# Altium project Nexie.PrjPcb
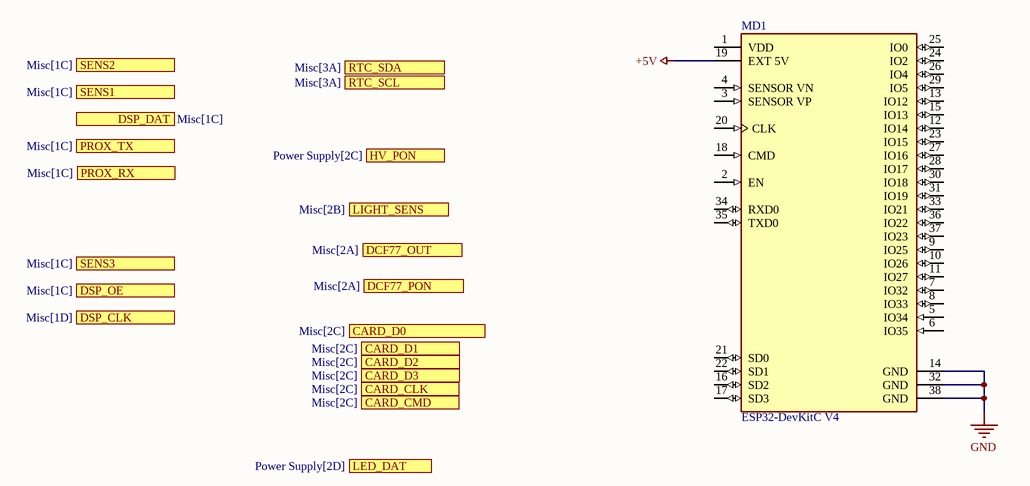
[diagram p0: MCU.SchDoc]
4 sheets, 70 parts. Net scope: flat (ports and power ports of the same name join across sheets).
Board files: PCB1.PcbDoc, PCB2.PcbDoc
Sheets:
  MCU.SchDoc
  Power Supply.SchDoc
  Misc.SchDoc
  Display.SchDoc

## Sheet MCU.SchDoc
size A; SheetNumber: 1; SheetTotal: 4

### Parts
MD1  ESP32-DevKitC V4  [FP-ESP32-DevKitC_V4-MFG]

### Ports
CARD_CLK (see Misc[2C]), CARD_CMD (see Misc[2C]), CARD_D0 (see Misc[2C]), CARD_D1 (see Misc[2C]), CARD_D2 (see Misc[2C]), CARD_D3 (see Misc[2C]), DCF77_OUT (see Misc[2A]), DCF77_PON (see Misc[2A]), DSP_CLK (see Misc[1D]), DSP_DAT (see Misc[1C]), DSP_OE (see Misc[1C]), HV_PON (see Power Supply[2C]), LED_DAT (see Power Supply[2D]), LIGHT_SENS (see Misc[2B]), PROX_RX (see Misc[1C]), PROX_TX (see Misc[1C]), RTC_SCL (see Misc[3A]), RTC_SDA (see Misc[3A]), SENS1 (see Misc[1C]), SENS2 (see Misc[1C]), SENS3 (see Misc[1C])

### Nets
+5V: MD1.19(EXT_5V)
GND: MD1.14(GND) MD1.32(GND) MD1.38(GND)

Not connected (* = marked no-connect by the designer): MD1 1(VDD) 2(EN) 3(SENSOR_VP) 4(SENSOR_VN) 5(IO34) 6(IO35) 7(IO32) 8(IO33) 9(IO25) 10(IO26) 11(IO27) 12(IO14) 13(IO12) 15(IO13) 16(SD2) 17(SD3) 18(CMD) 20(CLK) 21(SD0) 22(SD1) 23(IO15) 24(IO2) 25(IO0) 26(IO4) 27(IO16) 28(IO17) 29(IO5) 30(IO18) 31(IO19) 33(IO21) 34(RXD0) 35(TXD0) 36(IO22) 37(IO23)

### Library data of the parts
MD1 = CMP-194065-000004-1: WiFi Development Tools (802.11) ESP32 General Development Kit, ESP32-WROOM-32 on the board; Manufacturer: Espressif; Number Of Adc Channels: 16; Max Supply Voltage: 5V; Bandwidth: 2.4-2.5GHz; Interface: I2C,SPI,UART,I2S; Max Frequency: 2.5GHz; Min Supply Voltage: 2.7V; Number Of Gpio: 22; Package: ESP32-DevKitC V4; Device Class L2: RF Semiconductors and Devices; Device Class L3: Transceivers; ComponentLink2Description: Datasheet; Temperature Range Low: -40°C; ComponentLink2URL: https://docs.espressif.com/projects/esp-idf/en/latest/get-started/get-started-devkitc.html; RoHS: TRUE; Category: UNK; Automotive: No; Device Class L1: Integrated Circuits (ICs); Manufacturer Part Number: ESP32-DevKitC V4; Octopart: https://octopart.com/esp32-devkitc+v4-espressif+systems-107467262; Lead Free: Yes; Temperature: -40°C to

## Sheet Power Supply.SchDoc
size A; SheetNumber: 2; SheetTotal: 4
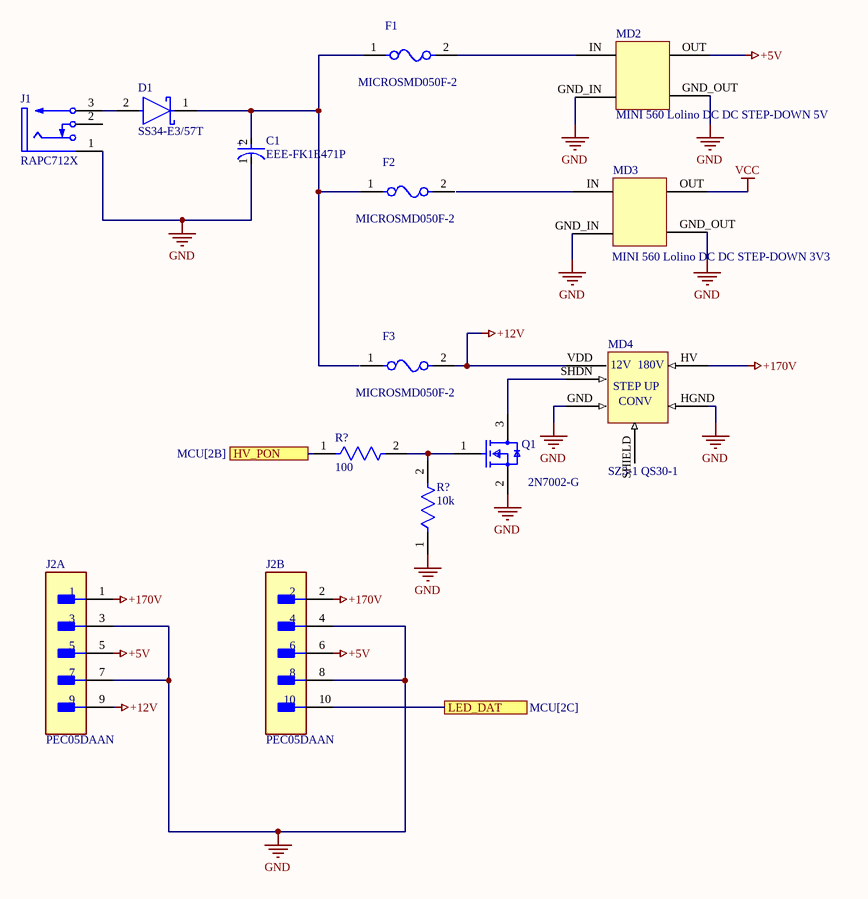
[diagram p1: Power Supply.SchDoc]

### Parts
(Parts that share a designator on the sheet are numbered #1, #2 ... from top to bottom, then left to right.)
C1  EEE-FK1E471P  [FP-FKG-MFG]
D1  SS34-E3/57T  [FP-95402-MFG]
F1  MICROSMD050F-2  [FP-microSMD-MFG]
F2  MICROSMD050F-2  [FP-microSMD-MFG]
F3  MICROSMD050F-2  [FP-microSMD-MFG]
J1  RAPC712X  [SWITCH-RAPC712X-3_V]
J2  PEC05DAAN  [FP-PEC05DAAN-MFG]  (parts A,B of 2)
MD2  MINI 560 Lolino DC DC STEP-DOWN 5V  [MINI 560 Lolino DC DC STEP-DOWN]
MD3  MINI 560 Lolino DC DC STEP-DOWN 3V3  [MINI 560 Lolino DC DC STEP-DOWN]
MD4  SZ3-1 QS30-1  [STEP_UP_180V]
Q1  2N7002-G  [FP-2N7002-G-IPC_C]
R?#1  100  [FP-RC0805-0_6-IPC_C]
R?#2  10k  [FP-RC0805-0_6-IPC_C]

### Ports
HV_PON (see MCU[2B]), LED_DAT (see MCU[2C])

### Nets
+5V: J2.5 J2.6 MD2.OUT
+12V: F3.2 J2.9 MD4.VDD
+170V: J2.1 J2.2 MD4.HV
GND: C1.1(C) J1.1 J2.3 J2.4 J2.7 J2.8 MD2.GND_IN MD2.GND_OUT MD3.GND_IN MD3.GND_OUT MD4.GND MD4.HGND Q1.2(SOURCE) R?#2.1
VCC: MD3.OUT
NetC1_2: C1.2(A) D1.1(C) F1.1 F2.1
NetD1_2: D1.2(A) J1.3
NetF1_2: F1.2 MD2.IN
NetJ2_10: J2.10 ; port LED_DAT
NetMD4_SHDN: MD4.SHDN Q1.3(DRAIN)
NetQ1_1: Q1.1(GATE) R?#1.2 R?#2.2
NetR?#1_1: R?#1.1 ; port HV_PON

Not connected (* = marked no-connect by the designer): F2 2; F3 1; J1 2; MD3 IN; MD4 SHIELD

### Notes on the sheet
- (in symbol CMP-05427-000095-1) +
- (in symbol STEP_UP_180V_MODULE) 12V; 180V; STEP UP; CONV

### Library data of the parts
C1 = CMP-05427-000095-1: CAP ALUM 470UF 20% 25V SMD; Dielectric Material: Aluminium; Life (Hours): 2000Hour; Impedance: 80mR; Leakage Current: 3uA; Polarity: Polar; Ripple Current (AC): 850mA; Packaging: Tape and Reel; Height: 10.2mm; Radiation Hardening: No; Mount: Surface Mount; Min Operating Temperature: -55°C; ESR (Equivalent Series Resistance): 80mR; Tolerance: 20%; Max Operating Temperature: 105°C; Contact Plating: Tin; Length: 10.2mm; Number of Pins: 2; Capacitance: 470uF; Case/Package: Radial; Height - Seated (Max): 0.413inch; Voltage Rating (DC): 25V; Construction: Cylindrical; Lead Free: Lead Free; Voltage: 25V; Material: Aluminium; Package Quantity: 500; Width: 12mm; Series: FK; RoHS Compliant: Yes; Voltage Rating: 25V; Ripple Current: 850mA; Termination: SMD/SMT; Diameter: 10mm
D1 = CMP-02539-000012-1: DIODE SCHOTTKY 40V 3A DO214AB; Manufacturer: Vishay; Max Junction Temp: +150°C; Peak Reverse Current: 0.5mA; Max Surge Forward Current: 100A; Standoff Height: 0mm; ComponentLink2Description: Datasheet; Device Class L3: Schottky Diodes; Height: 2.62mm; Max Repetitive Reverse Voltage: 40V; Lead Free: Yes; Package: 95402; Temperature Range High: +150°C; ComponentLink2URL: http://www.vishay.com/docs/88751/ss32.pdf; Temperature: -55°C to +150°C; Footprint Url: http://www.vishay.com/docs/95402/smc.pdf; Automotive: No; Forward Current: 3A; Category: Diode; Manufacturer Part Number: SS34-E3/57T; RoHS: TRUE; Device Class L2: Diodes; Mouser Description: Schottky Diodes & Rectifiers 3.0 Amp 40 Volt; Octopart: https://octopart.com/ss34-e3%2F57t-vishay-39552907; Temperature Range Low: -55°C; Device Class L1: Discrete Semiconductors; Digikey Description: DIODE SCHOTTKY 40V 3A DO214AB
F1-F3 = CMP-08606-000015-1: PTC RESET FUSE 13.2V 500MA 1210; Manufacturer: Littelfuse; Hold Current: 0.5A; Resistance: 0.25-0.9Ω; Trip Time: 0.05s; Value: 0.25-0.9Ω; Trip Current: 1A; Current Rating: 40A; Device Class L3: unset; ComponentLink2URL: https://www.littelfuse.com/~/media/electronics/datasheets/resettable_ptcs/littelfuse_ptc_microsmd_datasheet.pdf.pdf; Temperature: to +85°C; ComponentLink2Description: Datasheet; RoHS: TRUE; Category: Fuse; Ambient Temperature Range Low: -40°C; Lead Free: Yes; Device Class L1: Circuit Protection; Manufacturer Part Number: MICROSMD050F-2; Temperature Range High: +85°C; Ambient Temperature Range High: +85°C; Automotive: No; Height: 0.62mm; Digikey Description: PTC RESET FUSE 13.2V 500MA 1210; Voltage Rating: 13.2V; Package: microSMD; Octopart: https://octopart.com/microsmd050f-2-littelfuse-74214982; Device Class L2: PTC Resettable Fuses
J1 = CMP-2000-05383-1: Conn Powerjack Mini R/A PCMT, 5 A, 3-Pin THD, RoHS; Manufacturer: Switchcraft; Gender: Male; Current Rating: 5A; Connector Type: Jack; Dynamic Catalog: SwitchcraftInc; Other Names: Q2387461 / Q2526383 / RAPC712X-ND / SC237; Internal Switch(s): SingleSwitch,NormallyClosed; Catalog Drawings: RAPC7(1,2)2XSide / RAPC7(1,2)2XTop; Plug/Mating Plug Diameter: 2.5mmID,5.5mmOD; Number of Positions/Contacts: 2Conductors,2Contacts; Shielding: Unshielded; Mating Products: SC1539-ND / -CONNPLUGMINIPWR2CONDBLK/RED / SC1051-ND / -CONNPLUGMINIPOWER2CONDBLACK; Mounting Type: ThroughHole,RightAngle; Manufacturer URL: http://www.switchcraft.com/; Contact Material: Brass; Standard Package: 2,500; RoHS Information: SwitchcraftRoHSInfo; Termination: SolderEyelet(s); Housing Color: Black; Datasheet Version: Rev. A, 08/2005; Family: Barrel-PowerConnectors; Housing Material: Thermoplastic; Color: Black; Datasheet URL: https://datasheet.ciiva.com/391/rapc712x-cd-391666.pdf; Category: Connectors,Interconnects; Contact Material - Plating: Nickel
J2 = CMP-25680-000034-1: CONN HEADER VERT 10POS 2.54MM; Pitch: 0.1inch; Number of Positions: 10; Gender: Male; Connector Type: Male Pin; Contact Type: Male Pin; Height: 2.54mm; Termination: Solder; Packaging: Bulk; Housing Material: Plastic; Contact Mating Length: 0.23inch; Width: 5.08mm; Row Spacing: 0.1inch; Housing Color: Black; Mount: Through Hole; Contact Plating: Tin; Contact Material: Bronze; Color: Black; Package Quantity: 1; Length: 12.7mm; Lead Free: Lead Free; Number of Rows: 2; Number of Contacts: 10
MD2 MD3 = MINI 560 Lolino DC DC STEP-DOWN
MD4 = STEP_UP_180V_MODULE
Q1 = CMP-06369-000003-1: MOSFET N-CH 60V 0.115A SOT23-3; Manufacturer: Microchip; Standoff Height: 0.01mm; Rthja Max: 203°C/W; Continuous Drain Current: 115mA; Depletion Mode: False; Typ Forward Diode Voltage: 1.2V; Number Of Channels: 1; Power Dissipation: 0.36W; Turn Off Delay Time: 20ns; Threshold Vgs Min: 1V; Threshold Vgs Max: 2.5V; Drain To Source Resistance: 7.5Ω; Input Capacitace At Vds: 50pF @ 25V; Reverse Recovery Time: 400ns; Pulse Drain Current: 800mA; Gate To Source Voltage: 30V; Manufacturer Part Number: 2N7002-G; Ambient Temperature Range Low: -55°C; Temperature Range Low: -55°C; ComponentLink2Description: Datasheet; Automotive: No; Temperature Range High: +150°C; Temperature: -55°C to +150°C; Ambient Temperature Range High: +150°C; ComponentLink2URL: http://ww1.microchip.com/downloads/en/DeviceDoc/2N7002-N-Channel-Enhancement-Mode-Vertical-DMOS-FET-Data-Sheet-20005797A.pdf; Octopart: https://octopart.com/2n7002-g-microchip-47153309; Mouser Description: Mosfet; N-channel Enhancement Mode; 60V; 7.5 OHM3 SOT-23T/R; Lead Free: Yes; Number Of N Channels: 1; Turn On Delay Time: 20ns; RoHS: TRUE; Digikey Description: MOSFET N-CH 60V 0.115A SOT23-3; Category: Trans; Ipc Land Pattern Name: SOT95P237X100-3; Height: 1.12mm; Device Class L2: Transistors; Drain To Source Breakdown Voltage: 60V; Device Class L1: Discrete Semiconductors; Drain To Source Voltage: 60V; Device Class L3: MOSFETs; Package: 2N7002-G
R?#1 R?#2 = CMP-2100-03668-5: RES 100K OHM 1% 1/8W 0805; Power Rating: 125mW; Temperature Coefficient: 100ppm/°C; Voltage Rating (DC): 150V; Resistance: 100kR; Package Quantity: 1; Case/Package: 0805; Lead Pitch: 0.4mm; Case Code (Imperial): 0805; Construction: Rectangular; Number of Terminations: 2; RoHS Compliant: Yes; Max Power Dissipation: 125mW; Tolerance: 1%; Max Operating Temperature: 155°C; Resistance Tolerance: 1%; Lead Free: Lead Free; Packaging: Tape and Reel; Resistor Type: Thick Film; Min Operating Temperature: -55°C; Case Code (Metric): 2012; Series: RC; Technology: THICK FILM; Voltage Rating: 150V; Termination: SMD/SMT; Width: 0.049inch; Number of Pins: 2; Features: Moisture Resistant; Military Standard: Not; Length: 0.079inch; Depth: 1.25mm; Size Code: 0805; Height: 0.024inch

## Sheet Misc.SchDoc
size A; SheetNumber: 3; SheetTotal: 4
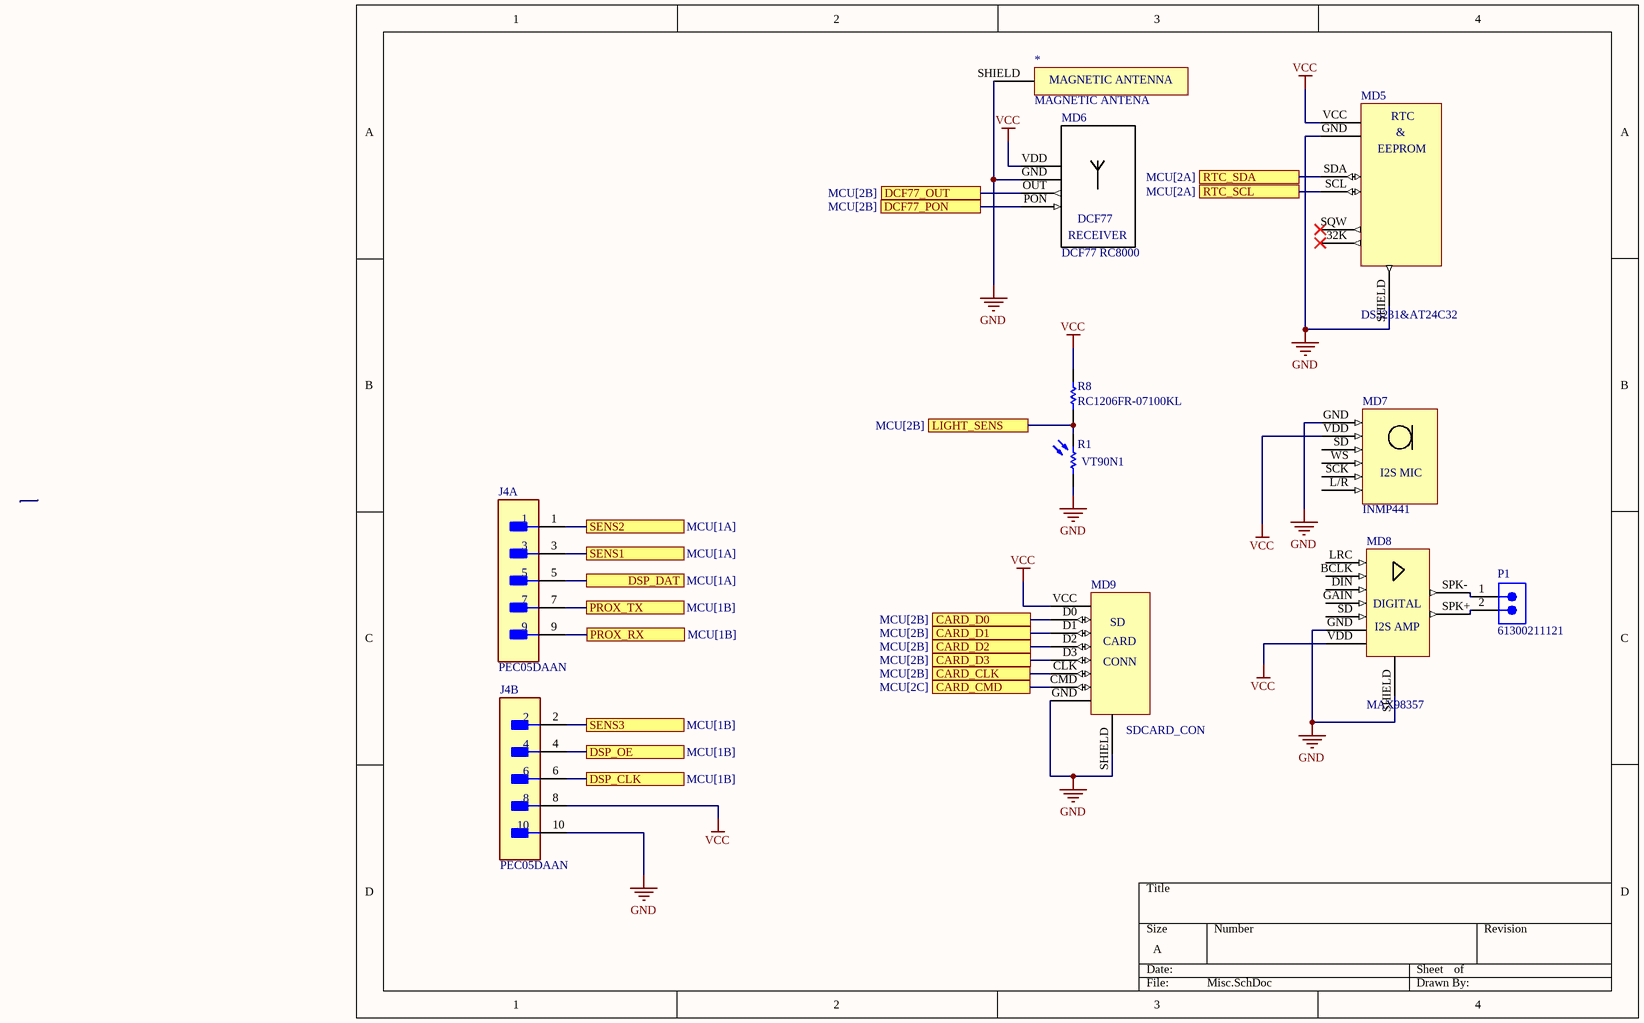
[diagram p2: Misc.SchDoc]

### Parts
*  MAGNETIC ANTENA  [MAGNETIC ANTENA]
J4  PEC05DAAN  [FP-PEC05DAAN-MFG]  (parts A,B of 2)
MD5  DS3231&AT24C32  [DS3231_MODULE]
MD6  DCF77 RC8000  [DFC77_MODULE]
MD7  INMP441  [INMP441_i2s_microphone_module]
MD8  MAX98357  [MAX98357]
MD9  SDCARD_CON  [SDCARD_CONN]
P1  61300211121  [61300211121]
R1  VT90N1  [EXCE-VT90N1]
R8  RC1206FR-07100KL  [RESC3116X65X40ML10T20]

### Ports
CARD_CLK (see MCU[2B]), CARD_CMD (see MCU[2C]), CARD_D0 (see MCU[2B]), CARD_D1 (see MCU[2B]), CARD_D2 (see MCU[2B]), CARD_D3 (see MCU[2B]), DCF77_OUT (see MCU[2B]), DCF77_PON (see MCU[2B]), DSP_CLK (see MCU[1B]), DSP_DAT (see MCU[1A]), DSP_OE (see MCU[1B]), LIGHT_SENS (see MCU[2B]), PROX_RX (see MCU[1B]), PROX_TX (see MCU[1B]), RTC_SCL (see MCU[2A]), RTC_SDA (see MCU[2A]), SENS1 (see MCU[1A]), SENS2 (see MCU[1A]), SENS3 (see MCU[1B])

### Nets
GND: *.SHIELD J4.10 MD5.GND MD5.SHIELD MD6.GND MD7.GND MD8.GND MD8.SHIELD MD9.GND MD9.SHIELD R1.1
VCC: J4.8 MD5.VCC MD6.VDD MD7.VDD MD8.VDD MD9.VCC R8.2
NetJ4_1: J4.1 ; port SENS2
NetJ4_2: J4.2 ; port SENS3
NetJ4_3: J4.3 ; port SENS1
NetJ4_4: J4.4 ; port DSP_OE
NetJ4_5: J4.5 ; port DSP_DAT
NetJ4_6: J4.6 ; port DSP_CLK
NetJ4_7: J4.7 ; port PROX_TX
NetJ4_9: J4.9 ; port PROX_RX
NetMD5_SCL: MD5.SCL ; port RTC_SCL
NetMD5_SDA: MD5.SDA ; port RTC_SDA
NetMD6_OUT: MD6.OUT ; port DCF77_OUT
NetMD6_PON: MD6.PON ; port DCF77_PON
NetMD8_SPK+: MD8.SPK+ P1.2
NetMD8_SPK-: MD8.SPK- P1.1
NetMD9_CLK: MD9.CLK ; port CARD_CLK
NetMD9_CMD: MD9.CMD ; port CARD_CMD
NetMD9_D0: MD9.D0 ; port CARD_D0
NetMD9_D1: MD9.D1 ; port CARD_D1
NetMD9_D2: MD9.D2 ; port CARD_D2
NetMD9_D3: MD9.D3 ; port CARD_D3
NetR1_2: R1.2 R8.1 ; port LIGHT_SENS

Not connected (* = marked no-connect by the designer): MD5 32K* SQW*; MD7 L/R SCK SD WS; MD8 BCLK DIN GAIN LRC SD

### Notes on the sheet
- (in symbol DCF77_MODULE) DCF77; RECEIVER
- (in symbol INMP441_I2S_MIC) I2S MIC
- (in symbol MAGNETIC ANTENA) MAGNETIC ANTENNA
- (in symbol MAX98357) DIGITAL; I2S AMP
- (in symbol RTC DS3231_MODULE) RTC; &; EEPROM
- (in symbol SDCARD_CON) SD; CARD; CONN

### Library data of the parts
J4 = CMP-25680-000034-1: as J2 on sheet Power Supply; Contact Type: Male Pin; Height: 2.54mm; Termination: Solder; Packaging: Bulk; Housing Material: Plastic; Contact Mating Length: 0.23inch; Width: 5.08mm; Row Spacing: 0.1inch; Housing Color: Black; Mount: Through Hole; Contact Plating: Tin; Contact Material: Bronze; Color: Black; Package Quantity: 1; Length: 12.7mm; Lead Free: Lead Free; Number of Rows: 2; Number of Contacts: 10
MD5 = RTC DS3231_MODULE
MD6 = DCF77_MODULE
MD7 = INMP441_I2S_MIC: Digital microphone
P1 = CMP-1712-00002-6: NexarPartId: 20081794; Number of Contacts: 2; Pitch: 2.54mm; Connector Type: Male Pin; Voltage Rating: 250V; Current Rating: 3A; Gender: Male; Contact Resistance: 20mΩ; Height: 8.94mm; Lead Free: Lead Free; Number of Pins: 2; Termination: Through Hole; RoHS: Compliant; Lead Pitch: 2.54mm; REACH SVHC: No SVHC; Housing Material: PBT; Contact Mating Length: 5.9944mm; Min Operating Temperature: -40°C; Orientation: Vertical; Contact Material: Copper; Contact Gender: Male; Max Operating Temperature: 125°C; Number of Rows: 1; Number of Positions: 2; Packaging: Bulk; Contact Plating: Gold; Mount: Through Hole; Color: Black; Operating Supply Voltage: 250V
R1 = CMP-2000-07406-1: Photoconductive Resistor, 200 kOhm, 100 V, 80 mW, -40 to 75 degC, 2-Pin THD, RoHS; Manufacturer: Excelitas Technology; SVHC: Cadmiumchloride(15-Jun-2015); Power Rating: 80mW; Resistance @ Lux: 12kohm; Voltage Rating: 100V; Product Range: -; Datasheet Version: 09/2006; Resistor Case Style: -; Operating Temperature Max: 75°C; Package Reference: VT90N1; Datasheet URL: http://datasheet.octopart.com/VT90N1-Excelitas-datasheet-10388451.pdf; Mounting Technology: ThroughHole; Operating Temperature Min: -40°C; Dark Resistance: 200kohm; Package Description: 2-Pin Through Hole Device, Body Width 4.17 mm (Max), Height 2.29 mm; Manufacturer URL: http://www.excelitas.com/Pages/Index.aspx; Packaging: Each
R8 = CMP-2100-03674-1: Chip Resistor, 100 KOhm, +/- 1%, 0.25 W, -55 to 155 degC, 1206 (3216 Metric), RoHS, Tape and Reel; Manufacturer: Yageo; Voltage Rating: 200V; Temperature Coefficient: 100ppm/degreesC; Power Rating: 250mW; Case Code (Metric): 3216; Composition: ThickFilm; Lead Free: LeadFree; Max Operating Temperature: 155degC; Case/Package: 1206; Min Operating Temperature: -55degC; Depth: 1.6mm; RoHSCompliant: true; Datasheet URL: http://www.yageo.com/NewPortal/yageodocoutput?fileName=/pdf/R-Chip/PYu-RC_Group_51_RoHS_L_5.pdf; Datasheet Version: Rev. 5, 10/2016; Package Reference: 1206.0; Packaging: TapeandReel; Resistance: 100KOhm; Manufacturer URL: http://www.yageo.com/; Tolerance: 1%; Height: 0.55mm; REACH SVHC: NoSVHC; Case Code (Imperial): 1206; Length: 3.1mm; Package Description: 2-Pin Surface Mount Device, Body 3.1 x 1.6 mm; Termination: SMD/SMT

## Sheet Display.SchDoc
size 420 x 297 mm; SheetNumber: 4; SheetTotal: 4
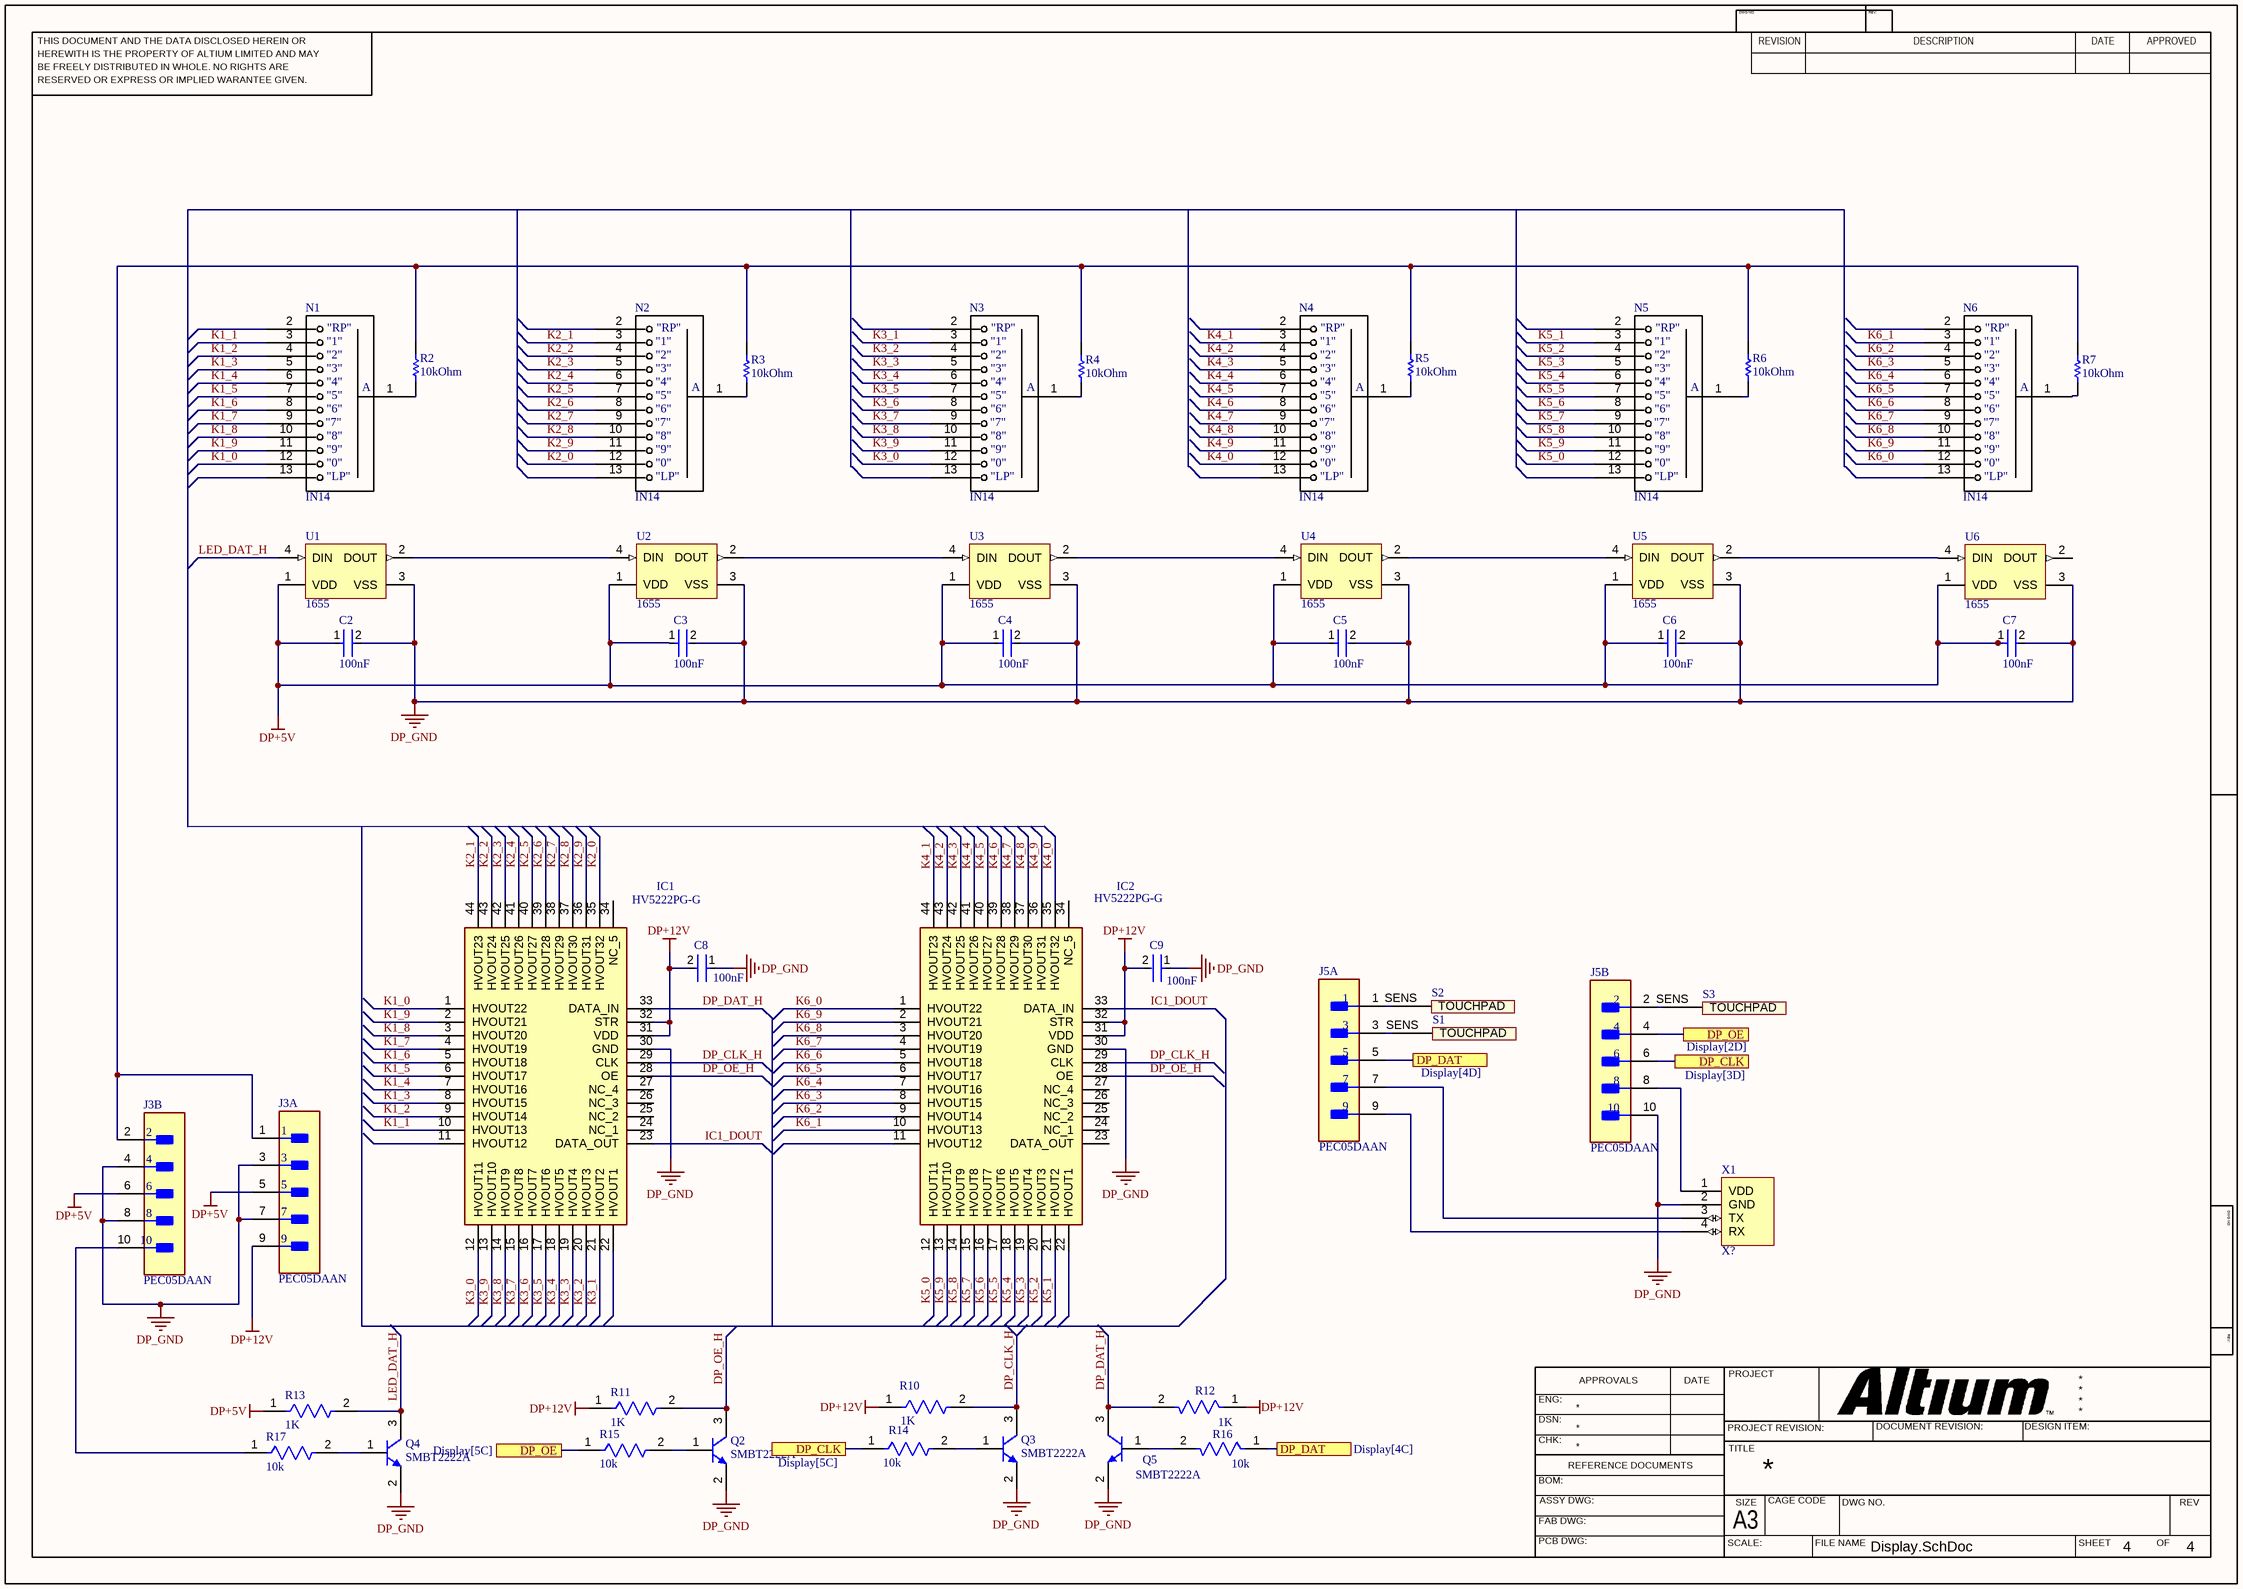
[diagram p3: Display.SchDoc]

### Parts
C2  100nF  [FP-CC0805-0_85-MFG]
C3  100nF  [FP-CC0805-0_85-MFG]
C4  100nF  [FP-CC0805-0_85-MFG]
C5  100nF  [FP-CC0805-0_85-MFG]
C6  100nF  [FP-CC0805-0_85-MFG]
C7  100nF  [FP-CC0805-0_85-MFG]
C8  100nF  [FP-CC0805-0_85-MFG]
C9  100nF  [FP-CC0805-0_85-MFG]
IC1  HV5222PG-G  [QFP80P1390X1390X235-44N]
IC2  HV5222PG-G  [QFP80P1390X1390X235-44N]
J3  PEC05DAAN  [FP-PEC05DAAN-MFG]  (parts A,B of 2)
J5  PEC05DAAN  [FP-PEC05DAAN-MFG]  (parts A,B of 2)
N1  IN14  [IN14]
N2  IN14  [IN14]
N3  IN14  [IN14]
N4  IN14  [IN14]
N5  IN14  [IN14]
N6  IN14  [IN14]
Q2  SMBT2222A  [INF-SOT23_L]
Q3  SMBT2222A  [INF-SOT23_L]
Q4  SMBT2222A  [INF-SOT23_L]
Q5  SMBT2222A  [INF-SOT23_L]
R2  10kOhm  [RESC3116X65X40ML10T20]
R3  10kOhm  [RESC3116X65X40ML10T20]
R4  10kOhm  [RESC3116X65X40ML10T20]
R5  10kOhm  [RESC3116X65X40ML10T20]
R6  10kOhm  [RESC3116X65X40ML10T20]
R7  10kOhm  [RESC3116X65X40ML10T20]
R10  1K  [FP-RC0805-0_6-IPC_C]
R11  1K  [FP-RC0805-0_6-IPC_C]
R12  1K  [FP-RC0805-0_6-IPC_C]
R13  1K  [FP-RC0805-0_6-IPC_C]
R14  10k  [FP-RC0805-0_6-IPC_C]
R15  10k  [FP-RC0805-0_6-IPC_C]
R16  10k  [FP-RC0805-0_6-IPC_C]
R17  10k  [FP-RC0805-0_6-IPC_C]
S1  (no value)  [SENS]
S2  TOUCHPAD  [SENS]  (value not drawn)
S3  TOUCHPAD  [SENS]  (value not drawn)
U1  1655  [ADA-RGB-1655_V]
U2  1655  [ADA-RGB-1655_V]
U3  1655  [ADA-RGB-1655_V]
U4  1655  [ADA-RGB-1655_V]
U5  1655  [ADA-RGB-1655_V]
U6  1655  [ADA-RGB-1655_V]
X1  X?  [4X1HEADER]

### Ports
DP_CLK (see Display[3D]), DP_CLK (see Display[5C]), DP_DAT (see Display[4C]), DP_DAT (see Display[4D]), DP_OE (see Display[2D]), DP_OE (see Display[5C])

### Nets
DP+5V: C2.1 C3.1 C4.1 C5.1 C6.1 C7.1 J3.5 J3.6 R13.1 U1.1(VDD) U2.1(VDD) U3.1(VDD) U4.1(VDD) U5.1(VDD) U6.1(VDD)
DP+12V: C8.2 C9.2 IC1.31(VDD) IC1.32(STR) IC2.31(VDD) IC2.32(STR) J3.9 R10.1 R11.1 R12.1
DP_GND: C2.2 C3.2 C4.2 C5.2 C6.2 C7.2 C8.1 C9.1 IC1.30(GND) IC2.30(GND) J3.3 J3.4 J3.7 J3.8 J5.10 Q2.2(E) Q3.2(E) Q4.2(E) Q5.2(E) U1.3(VSS) U2.3(VSS) U3.3(VSS) U4.3(VSS) U5.3(VSS) U6.3(VSS) X1.2(GND)
DP_CLK_H: IC1.29(CLK) IC2.29(CLK) Q3.3(C) R10.2
DP_DAT_H: IC1.33(DATA_IN) Q5.3(C) R12.2
DP_OE_H: IC1.28(OE) IC2.28(OE) Q2.3(C) R11.2
IC1_DOUT: IC1.23(DATA_OUT) IC2.33(DATA_IN)
K1_0: IC1.1(HVOUT22) N1.12
K1_1: IC1.10(HVOUT13) N1.3
K1_2: IC1.9(HVOUT14) N1.4
K1_3: IC1.8(HVOUT15) N1.5
K1_4: IC1.7(HVOUT16) N1.6
K1_5: IC1.6(HVOUT17) N1.7
K1_6: IC1.5(HVOUT18) N1.8
K1_7: IC1.4(HVOUT19) N1.9
K1_8: IC1.3(HVOUT20) N1.10
K1_9: IC1.2(HVOUT21) N1.11
K2_0: IC1.35(HVOUT32) N2.12
K2_1: IC1.44(HVOUT23) N2.3
K2_2: IC1.43(HVOUT24) N2.4
K2_3: IC1.42(HVOUT25) N2.5
K2_4: IC1.41(HVOUT26) N2.6
K2_5: IC1.40(HVOUT27) N2.7
K2_6: IC1.39(HVOUT28) N2.8
K2_7: IC1.38(HVOUT29) N2.9
K2_8: IC1.37(HVOUT30) N2.10
K2_9: IC1.36(HVOUT31) N2.11
K3_0: IC1.12(HVOUT11) N3.12
K3_1: IC1.21(HVOUT2) N3.3
K3_2: IC1.20(HVOUT3) N3.4
K3_3: IC1.19(HVOUT4) N3.5
K3_4: IC1.18(HVOUT5) N3.6
K3_5: IC1.17(HVOUT6) N3.7
K3_6: IC1.16(HVOUT7) N3.8
K3_7: IC1.15(HVOUT8) N3.9
K3_8: IC1.14(HVOUT9) N3.10
K3_9: IC1.13(HVOUT10) N3.11
K4_0: IC2.35(HVOUT32) N4.12
K4_1: IC2.44(HVOUT23) N4.3
K4_2: IC2.43(HVOUT24) N4.4
K4_3: IC2.42(HVOUT25) N4.5
K4_4: IC2.41(HVOUT26) N4.6
K4_5: IC2.40(HVOUT27) N4.7
K4_6: IC2.39(HVOUT28) N4.8
K4_7: IC2.38(HVOUT29) N4.9
K4_8: IC2.37(HVOUT30) N4.10
K4_9: IC2.36(HVOUT31) N4.11
K5_0: IC2.12(HVOUT11) N5.12
K5_1: IC2.21(HVOUT2) N5.3
K5_2: IC2.20(HVOUT3) N5.4
K5_3: IC2.19(HVOUT4) N5.5
K5_4: IC2.18(HVOUT5) N5.6
K5_5: IC2.17(HVOUT6) N5.7
K5_6: IC2.16(HVOUT7) N5.8
K5_7: IC2.15(HVOUT8) N5.9
K5_8: IC2.14(HVOUT9) N5.10
K5_9: IC2.13(HVOUT10) N5.11
K6_0: IC2.1(HVOUT22) N6.12
K6_1: IC2.10(HVOUT13) N6.3
K6_2: IC2.9(HVOUT14) N6.4
K6_3: IC2.8(HVOUT15) N6.5
K6_4: IC2.7(HVOUT16) N6.6
K6_5: IC2.6(HVOUT17) N6.7
K6_6: IC2.5(HVOUT18) N6.8
K6_7: IC2.4(HVOUT19) N6.9
K6_8: IC2.3(HVOUT20) N6.10
K6_9: IC2.2(HVOUT21) N6.11
LED_DAT_H: Q4.3(C) R13.2 U1.4(DIN)
NetJ3_1: J3.1 J3.2 R2.2 R3.2 R4.2 R5.2 R6.2 R7.2
NetJ3_10: J3.10 R17.1
NetJ5_1: J5.1 S2.SENS(TOUCHPAD)
NetJ5_2: J5.2 S3.SENS(TOUCHPAD)
NetJ5_3: J5.3 S1.SENS(TOUCHPAD)
NetJ5_4: J5.4 R15.1 ; port DP_OE
NetJ5_5: J5.5 R16.1 ; port DP_DAT
NetJ5_6: J5.6 R14.1 ; port DP_CLK
NetJ5_7: J5.7 X1.3(TX)
NetJ5_8: J5.8 X1.1(VDD)
NetJ5_9: J5.9 X1.4(RX)
NetN1_1: N1.1 R2.1
NetN2_1: N2.1 R3.1
NetN3_1: N3.1 R4.1
NetN4_1: N4.1 R5.1
NetN5_1: N5.1 R6.1
NetN6_1: N6.1 R7.1
NetQ2_1: Q2.1(B) R15.2
NetQ3_1: Q3.1(B) R14.2
NetQ4_1: Q4.1(B) R17.2
NetQ5_1: Q5.1(B) R16.2
NetU1_2: U1.2(DOUT) U2.4(DIN)
NetU2_2: U2.2(DOUT) U3.4(DIN)
NetU3_2: U3.2(DOUT) U4.4(DIN)
NetU4_2: U4.2(DOUT) U5.4(DIN)
NetU5_2: U5.2(DOUT) U6.4(DIN)

Not connected (* = marked no-connect by the designer): IC1 11(HVOUT12) 22(HVOUT1) 24(NC_1) 25(NC_2) 26(NC_3) 27(NC_4) 34(NC_5); IC2 11(HVOUT12) 22(HVOUT1) 23(DATA_OUT) 24(NC_1) 25(NC_2) 26(NC_3) 27(NC_4) 34(NC_5); N1 2 13; N2 2 13; N3 2 13; N4 2 13; N5 2 13; N6 2 13; U6 2(DOUT)

### Notes on the sheet
- THIS DOCUMENT AND THE DATA DISCLOSED HEREIN OR
- HEREWITH IS THE PROPERTY OF ALTIUM LIMITED AND MAY
- DWG NO:
- REVISION
- REV:
- DESCRIPTION
- DATE
- APPROVED
- BE FREELY DISTRIBUTED IN WHOLE. NO RIGHTS ARE
- RESERVED OR EXPRESS OR IMPLIED WARANTEE GIVEN.
- ENG:
- APPROVALS
- PROJECT
- DSN:
- CHK:
- REFERENCE DOCUMENTS
- PROJECT REVISION:
- TITLE
- DOCUMENT REVISION:
- DESIGN ITEM:
- BOM:
- FAB DWG:
- PCB DWG:
- ASSY DWG:
- SCALE:
- A3
- SIZE
- CAGE CODE
- FILE NAME
- DWG NO.
- SHEET
- OF
- REV
- (in symbol IN14) "RP"; "1"; "2"; "3"; "4"; A; "5"; "6"; "7"; "8"; "9"; "0"; "LP"

### Library data of the parts
C2-C9 = CMP-2100-03606-3: CAP CER 0.1UF 50V X7R 0805; Manufacturer Part Number: CC0805KRX7R9BB104; Manufacturer: Yageo; Tolerance: 0.1; Material: Ceramic; Device Class L1: Passive Components; ComponentLink2Description: Datasheet; Package: CC0805-0.85; Digikey Description: CAP CER 0.1UF 50V X7R 0805; Capacitance: 100 nF; Device Class L3: Ceramic Capacitors; Value: 100 nF; Temperature: -30°C to +85°C; Temperature Characteristic: X7R; Voltage Rating: 50 V; Height: 0.95mm; RoHS: TRUE; Ipc Land Pattern Name: CAPC200125X85; Device Class L2: Capacitors; Category: Cap; Temperature Range Low: -30°C; Temperature Range High: +85°C; Mouser Description: Multilayer Ceramic Capacitors MLCC - SMD/SMT 100nF 50V X7R 10%; Footprint Url: http://www.yageo.com/exep/pages/download/literatures/UPY-C_GEN_24.pdf; Automotive: No; Octopart: https://octopart.com/cc0805krx7r9bb104-yageo-192993; Lead Free: Yes; ComponentLink2URL: http://www.yageo.com/documents/recent/UPY-GPHC_Y5V_6.3V-to-50V_8.pdf
IC1 IC2 = HV5222PG-G: Integrated Circuit; Manufacturer_Name: Microchip; Datasheet Link: http://www.microchip.com/mymicrochip/filehandler.aspx?ddocname=en570722; Height: 2.35mm; Manufacturer_Part_Number: HV5222PG-G; Mouser Part Number: 689-HV5222PG-G; Mouser Price/Stock: https://www.mouser.co.uk/ProductDetail/Microchip-Technology/HV5222PG-G?qs=jjdktuRV%2Fgh6FkXzyQ9ehg%3D%3D; Arrow Part Number: HV5222PG-G; Arrow Price/Stock: https://www.arrow.com/en/products/hv5222pg-g/microchip-technology
J3 J5 = CMP-25680-000034-1: as J2 on sheet Power Supply; Contact Type: Male Pin; Height: 2.54mm; Termination: Solder; Packaging: Bulk; Housing Material: Plastic; Contact Mating Length: 0.23inch; Width: 5.08mm; Row Spacing: 0.1inch; Housing Color: Black; Mount: Through Hole; Contact Plating: Tin; Contact Material: Bronze; Color: Black; Package Quantity: 1; Length: 12.7mm; Lead Free: Lead Free; Number of Rows: 2; Number of Contacts: 10
Q2-Q5 = CMP-1178-00004-1: NPN Silicon Switching Transistor, 40 V VCEO, 600 mA IC, SOT23, Reel, Green; Manufacturer: Infineon; IC (max): 600 mA; IC: 150 mA; VCE: 10 V; VCEO (max): 40 V; VCBO (max): 75 V; VEBO (max): 6 V; ICBO (max): 10 nA; Green: TRUE; Mounting Technology: Surface Mount; PackageDescription: 3-Pin Small Outline Transistor Package, 1.3 x 2.9 mm Body, 0.95 mm Pitch; ComponentLink1Description: Manufacturer URL; ComponentLink3URL: http://www.infineon.com/dgdl/SOT23-Package_Overview.pdf?folderId=db3a30431936bc4b0119532290053c66&fileId=db3a30431936bc4b0119533468123c85; PackageVersion: Apr-08; VCE (max): 10 V; ComponentLink1URL: http://www.infineon.com/; Packing: Reel; ComponentLink2URL: http://www.infineon.com/dgdl/smbt2222a_mmbt2222a.pdf?folderId=db3a30431441fb5d011445fab851018e&fileId=db3a30431441fb5d011445fbaff0018f; PartNumber: SMBT2222A; PackageReference: SOT23; ComponentLink3Description: Package Specification; Polarity: NPN; ComponentLink2Description: Datasheet
R2-R7 = CMP-2100-03674-1: as R8 on sheet Misc; Case Code (Metric): 3216; Composition: ThickFilm; Lead Free: LeadFree; Max Operating Temperature: 155degC; Case/Package: 1206; Min Operating Temperature: -55degC; Depth: 1.6mm; RoHSCompliant: true; Datasheet URL: http://www.yageo.com/NewPortal/yageodocoutput?fileName=/pdf/R-Chip/PYu-RC_Group_51_RoHS_L_5.pdf; Datasheet Version: Rev. 5, 10/2016; Package Reference: 1206.0; Packaging: TapeandReel; Resistance: 100KOhm; Manufacturer URL: http://www.yageo.com/; Tolerance: 1%; Height: 0.55mm; REACH SVHC: NoSVHC; Case Code (Imperial): 1206; Length: 3.1mm; Package Description: 2-Pin Surface Mount Device, Body 3.1 x 1.6 mm; Termination: SMD/SMT
R10-R17 = CMP-2100-03668-5: as R?#1 on sheet Power Supply; Package Quantity: 1; Case/Package: 0805; Lead Pitch: 0.4mm; Case Code (Imperial): 0805; Construction: Rectangular; Number of Terminations: 2; RoHS Compliant: Yes; Max Power Dissipation: 125mW; Tolerance: 1%; Max Operating Temperature: 155°C; Resistance Tolerance: 1%; Lead Free: Lead Free; Packaging: Tape and Reel; Resistor Type: Thick Film; Min Operating Temperature: -55°C; Case Code (Metric): 2012; Series: RC; Technology: THICK FILM; Voltage Rating: 150V; Termination: SMD/SMT; Width: 0.049inch; Number of Pins: 2; Features: Moisture Resistant; Military Standard: Not; Length: 0.079inch; Depth: 1.25mm; Size Code: 0805; Height: 0.024inch
S1-S3 = SENS
U1-U6 = CMP-2000-05026-1: Intelligent Control LED Integrated Light Source, 3.5 to 5.3 V, -25 to 80 degC, 4-Pin SMD, RoHS, Tape and Reel; Manufacturer: Adafruit-Industries-LLC; Number of LEDs: 10; Configuration: Discrete; Utilized LED: WS2812(5050); Datasheet URL: http://datasheet.octopart.com/ADA1655-Adafruit-Industries-datasheet-32028139.pdf; Series: Neopixel; Interface: -; Package Description: 4-Pin Surface Mount Device, Body 5 x 5 mm; Color: Red,Green,Blue(RGB); Category: Optoelectronics; Controller Type: -; Package Reference: 1655; Manufacturer URL: https://www.adafruit.com/; Mounting Type: SurfaceMount; Datasheet Version: May-13; Size / Dimension: 5.00mmLx5.00mmW; Family: Addressable,Specialty
X1 = UART_HEEADER

## Nets that join several sheets
+5V: MCU (MD1.19), Power Supply (J2.5 J2.6 MD2.OUT)
GND: MCU (MD1.14 MD1.32 MD1.38), Power Supply (14 pins), Misc (11 pins)
VCC: Power Supply (MD3.OUT), Misc (7 pins)